# Altium schematic sheet napajanje.SchDoc
size A4
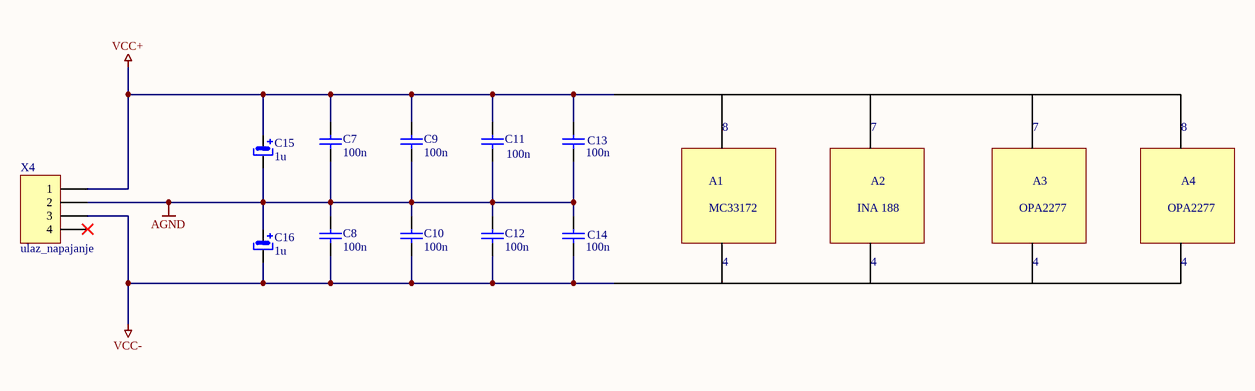
[diagram p0: napajanje.SchDoc]

## Parts
C7  100n  [C0805]
C8  100n  [C0805]
C9  100n  [C0805]
C10  100n  [C0805]
C11  100n  [C0805]
C12  100n  [C0805]
C13  100n  [C0805]
C14  100n  [C0805]
C15  1u  [6-0805_M]
C16  1u  [6-0805_M]
X4  ulaz_napajanje  [HDR1X4]

## Nets
AGND: C7.1 C8.2 C9.1 C10.2 C11.1 C12.2 C13.1 C14.2 C15.2 C16.1 X4.2
VCC+: C7.2 C9.2 C11.2 C13.2 C15.1 X4.1
VCC-: C8.1 C10.1 C12.1 C14.1 C16.2 X4.3

Not connected (* = marked no-connect by the designer): X4 4*

## Notes on the sheet
- 8
- 7
- A1
- MC33172
- INA 188
- A2
- OPA2277
- A3
- A4
- 4

## Library data of the parts
C7-C14 = Cap: Capacitor; Value: 100pF; cijena [£]: 0.146; Kat.broj: 1301717; Published: 8-Jun-2000; LatestRevisionDate: 17-Jul-2002; LatestRevisionNote: Re-released for DXP Platform.; PackageReference: RAD-0.3; Publisher: Altium Limited; PackageDescription: Radial Cap, Thru-Hole; 2 Leads; 0.3 in Pin Spacing
C15 C16 = elko: cijena [£]: 0.521; Kat.broj: 1658221
X4 = Header 4H: Header, 4-Pin, Right Angle; cijena [£]: 1.38; Kat.broj: 2554950; LatestRevisionDate: 17-Jul-2002; LatestRevisionNote: Re-released for DXP Platform.; Publisher: Altium Limited